# Altium schematic sheet Interface_Unit.SchDoc
size A4
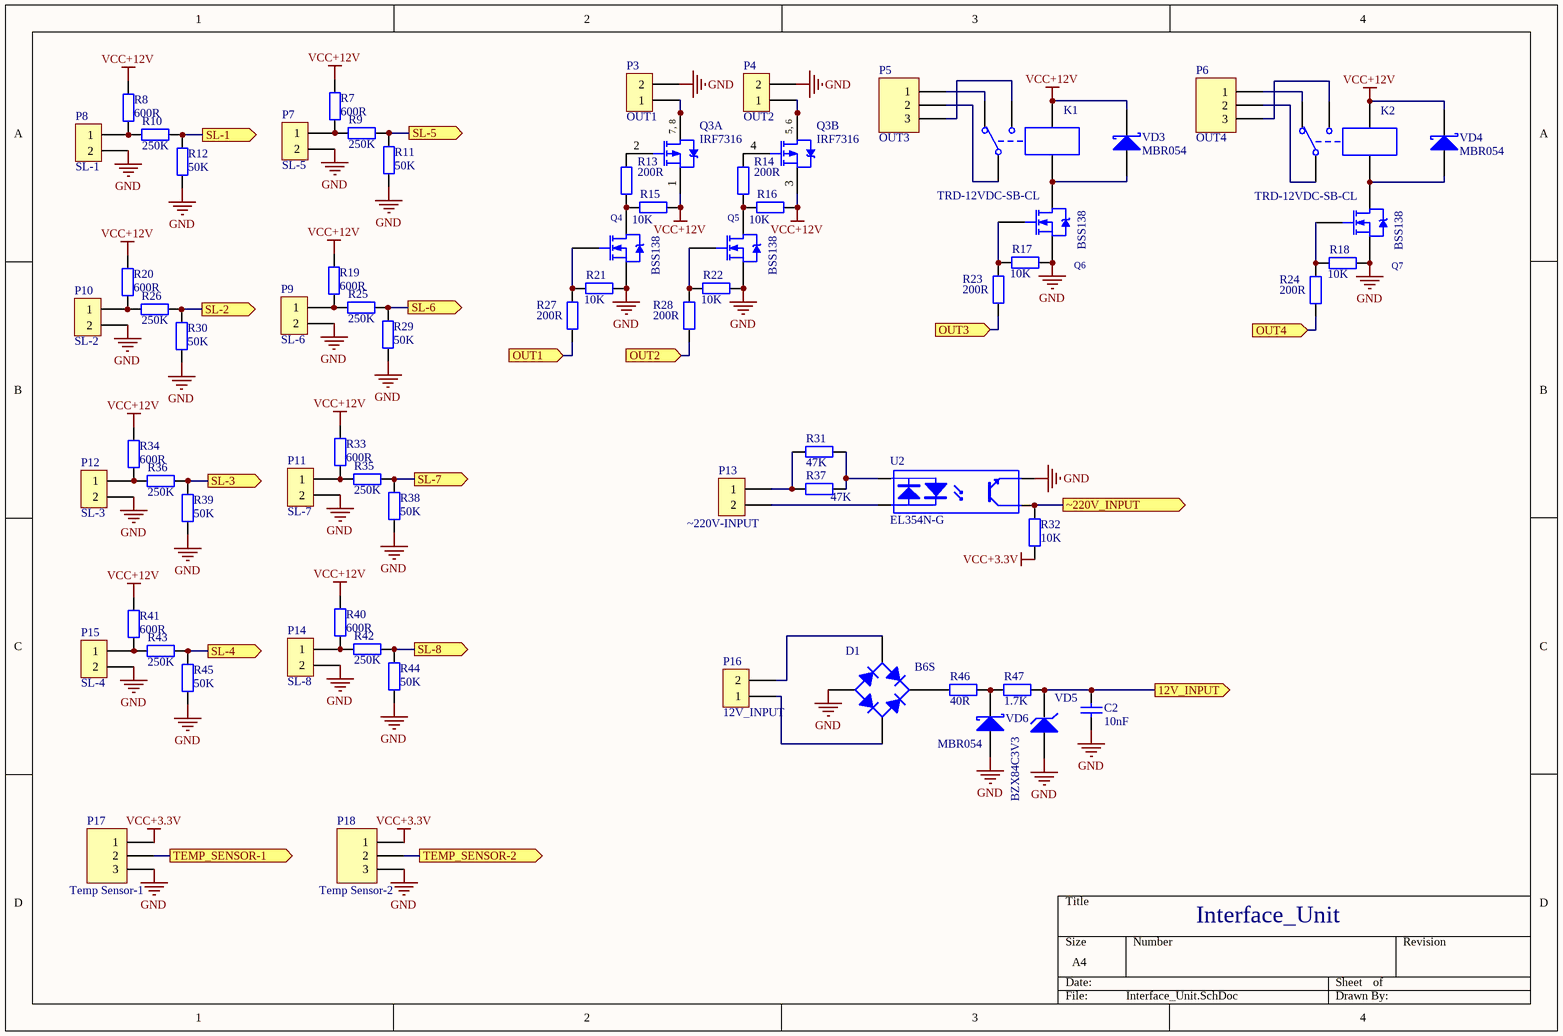
[diagram p0: Interface_Unit.SchDoc]

## Parts
C2  value 10nF  [C0603]  (hidden comment: 0805)
D1  B6S  [B6S]
K1  TRD-12VDC-SB-CL  [TRD-C Type]
K2  TRD-12VDC-SB-CL  [TRD-C Type]
P3  15EDGRC-3.5-02P  [15EDGRC-3.5-02P]  (value not drawn)
P4  15EDGRC-3.5-02P  [15EDGRC-3.5-02P]  (value not drawn)
P5  OUT3  [15EDGRC-3.5-03P]
P6  OUT4  [15EDGRC-3.5-03P]
P7  15EDGRC-3.5-02P  [15EDGRC-3.5-02P]  (value not drawn)
P8  15EDGRC-3.5-02P  [15EDGRC-3.5-02P]  (value not drawn)
P9  15EDGRC-3.5-02P  [15EDGRC-3.5-02P]  (value not drawn)
P10  15EDGRC-3.5-02P  [15EDGRC-3.5-02P]  (value not drawn)
P11  15EDGRC-3.5-02P  [15EDGRC-3.5-02P]  (value not drawn)
P12  15EDGRC-3.5-02P  [15EDGRC-3.5-02P]  (value not drawn)
P13  15EDGRC-3.5-02P  [15EDGRC-3.5-02P]  (value not drawn)
P14  15EDGRC-3.5-02P  [15EDGRC-3.5-02P]  (value not drawn)
P15  15EDGRC-3.5-02P  [15EDGRC-3.5-02P]  (value not drawn)
P16  15EDGRC-3.5-02P  [15EDGRC-3.5-02P]  (value not drawn)
P17  Temp Sensor-1  [15EDGRC-3.5-03P]
P18  Temp Sensor-2  [15EDGRC-3.5-03P]
Q3  IRF7316  [SO-8_N]  (parts A,B of 2)
Q4  BSS138  [SOT23]
Q5  BSS138  [SOT23]
Q6  BSS138  [SOT23]
Q7  BSS138  [SOT23]
R7  value 600R  [SMD-1206]  (hidden comment: RES_SMD)
R8  value 600R  [SMD-1206]  (hidden comment: RES_SMD)
R9  value 250K  [C0603]  (hidden comment: RES_SMD)
R10  value 250K  [C0603]  (hidden comment: RES_SMD)
R11  value 50K  [C0603]  (hidden comment: RES_SMD)
R12  value 50K  [C0603]  (hidden comment: RES_SMD)
R13  value 200R  [C0603]  (hidden comment: RES_SMD)
R14  value 200R  [C0603]  (hidden comment: RES_SMD)
R15  value 10K  [C0603]  (hidden comment: RES_SMD)
R16  value 10K  [C0603]  (hidden comment: RES_SMD)
R17  value 10K  [C0603]  (hidden comment: RES_SMD)
R18  value 10K  [C0603]  (hidden comment: RES_SMD)
R19  value 600R  [SMD-1206]  (hidden comment: RES_SMD)
R20  value 600R  [SMD-1206]  (hidden comment: RES_SMD)
R21  value 10K  [C0603]  (hidden comment: RES_SMD)
R22  value 10K  [C0603]  (hidden comment: RES_SMD)
R23  value 200R  [C0603]  (hidden comment: RES_SMD)
R24  value 200R  [C0603]  (hidden comment: RES_SMD)
R25  value 250K  [C0603]  (hidden comment: RES_SMD)
R26  value 250K  [C0603]  (hidden comment: RES_SMD)
R27  value 200R  [C0603]  (hidden comment: RES_SMD)
R28  value 200R  [C0603]  (hidden comment: RES_SMD)
R29  value 50K  [C0603]  (hidden comment: RES_SMD)
R30  value 50K  [C0603]  (hidden comment: RES_SMD)
R31  value 47K  [SMD-2512]  (hidden comment: RES_SMD)
R32  value 10K  [C0603]  (hidden comment: RES_SMD)
R33  value 600R  [SMD-1206]  (hidden comment: RES_SMD)
R34  value 600R  [SMD-1206]  (hidden comment: RES_SMD)
R35  value 250K  [C0603]  (hidden comment: RES_SMD)
R36  value 250K  [C0603]  (hidden comment: RES_SMD)
R37  value 47K  [SMD-2512]  (hidden comment: RES_SMD)
R38  value 50K  [C0603]  (hidden comment: RES_SMD)
R39  value 50K  [C0603]  (hidden comment: RES_SMD)
R40  value 600R  [SMD-1206]  (hidden comment: RES_SMD)
R41  value 600R  [SMD-1206]  (hidden comment: RES_SMD)
R42  value 250K  [C0603]  (hidden comment: RES_SMD)
R43  value 250K  [C0603]  (hidden comment: RES_SMD)
R44  value 50K  [C0603]  (hidden comment: RES_SMD)
R45  value 50K  [C0603]  (hidden comment: RES_SMD)
R46  value 40R  [C0805]  (hidden comment: RES)
R47  value 1.7K  [C0805]  (hidden comment: RES)
U2  EL354N-G  [EL354N-G]
VD3  MBR054  [SOD-123]
VD4  MBR054  [SOD-123]
VD5  BZX84C3V3  [SOT23]
VD6  MBR054  [SOD-123]

## Ports
12V_INPUT (out), OUT1 (in), OUT2 (in), OUT3 (in), OUT4 (in), SL-1 (out), SL-2 (out), SL-3 (out), SL-4 (out), SL-5 (out), SL-6 (out), SL-7 (out), SL-8 (out), TEMP_SENSOR-1 (out), TEMP_SENSOR-2 (out), ~220V_INPUT (out)

## Nets
GND: C2.2 D1.3(A) P3.2 P4.2 P7.2 P8.2 P9.2 P10.2 P11.2 P12.2 P14.2 P15.2 P17.3 P18.3 Q4.2(S) Q5.2(S) Q6.2(S) Q7.2(S) R11.1 R12.1 R17.2 R18.2 R21.2 R22.2 R29.1 R30.1 R38.1 R39.1 R44.1 R45.1 U2.3 VD5.1(A) VD6.2(A)
VCC+3.3V: P17.1 P18.1 R32.1
VCC+12V: K1.2 K2.2 Q3.1(S) Q3.3(S) R7.2 R8.2 R15.2 R16.2 R19.2 R20.2 R33.2 R34.2 R40.2 R41.2 VD3.1(K) VD4.1(K)
12V_INPUT: C2.1 R47.2 VD5.3(K) ; port 12V_INPUT
OUT1: R27.1 ; port OUT1
OUT2: R28.1 ; port OUT2
OUT3: R23.1 ; port OUT3
OUT4: R24.1 ; port OUT4
SL-1: R10.2 R12.2 ; port SL-1
SL-2: R26.2 R30.2 ; port SL-2
SL-3: R36.2 R39.2 ; port SL-3
SL-4: R43.2 R45.2 ; port SL-4
SL-5: R9.2 R11.2 ; port SL-5
SL-6: R25.2 R29.2 ; port SL-6
SL-7: R35.2 R38.2 ; port SL-7
SL-8: R42.2 R44.2 ; port SL-8
TEMP_SENSOR-1: P17.2 ; port TEMP_SENSOR-1
TEMP_SENSOR-2: P18.2 ; port TEMP_SENSOR-2
~220V_INPUT: R32.2 U2.4 ; port ~220V_INPUT
NetD1_1: D1.1(K) R46.1
NetD1_2: D1.2(C) P16.1
NetD1_4: D1.4(C) P16.2
NetK1_1: K1.1 Q6.3(D) VD3.2(A)
NetK1_3: K1.3 P5.2
NetK1_4: K1.4 P5.1
NetK1_5: K1.5 P5.3
NetK2_1: K2.1 Q7.3(D) VD4.2(A)
NetK2_3: K2.3 P6.2
NetK2_4: K2.4 P6.1
NetK2_5: K2.5 P6.3
NetP3_1: P3.1 Q3.7(D) Q3.8(D)
NetP4_1: P4.1 Q3.5(D) Q3.6(D)
NetP7_1: P7.1 R7.1 R9.1
NetP8_1: P8.1 R8.1 R10.1
NetP9_1: P9.1 R19.1 R25.1
NetP10_1: P10.1 R20.1 R26.1
NetP11_1: P11.1 R33.1 R35.1
NetP12_1: P12.1 R34.1 R36.1
NetP13_1: P13.1 R31.1 R37.1
NetP13_2: P13.2 U2.1
NetP14_1: P14.1 R40.1 R42.1
NetP15_1: P15.1 R41.1 R43.1
NetQ3_2: Q3.2(G) R13.2
NetQ3_4: Q3.4(G) R14.2
NetQ4_1: Q4.1(G) R21.1 R27.2
NetQ4_3: Q4.3(D) R13.1 R15.1
NetQ5_1: Q5.1(G) R22.1 R28.2
NetQ5_3: Q5.3(D) R14.1 R16.1
NetQ6_1: Q6.1(G) R17.1 R23.2
NetQ7_1: Q7.1(G) R18.1 R24.2
NetR31_2: R31.2 R37.2 U2.2
NetR46_2: R46.2 R47.1 VD6.1(K)

Not connected (* = marked no-connect by the designer): VD5 2

## Notes on the sheet
- Interface_Unit
- (in symbol 15EDGRC-3.5-02P) SL-1; SL-2; SL-3; SL-4; SL-5; SL-6; SL-7; SL-8; OUT1; OUT2; |20V-INPUT; 12V_INPUT
- (in symbol IRF7316, part A) 7, 8
- (in symbol IRF7316, part B) 5, 6

## Library data of the parts
C2 = Capasitor_SMD_0805: Capasitor_SMD_0808/
D1 = B6S: Diode Bridge
P5 P6 P17 P18 = 15EDGRC-3.5-03P
Q3 = IRF7316: HEXFET Power MOSFET; Published: 8-Jun-2000; LatestRevisionDate: 13-Apr-2006; LatestRevisionNote: IPC-7351 Footprint Added.; DatasheetVersion: Aug-1997; PackageVersion: Feb-2001; PackageReference: SO-8; Publisher: Altium Limited; PackageDescription: 8-Pin Plastic Small Outline Integrated Circuit 1.27 mm Pitch; Code_JEDEC: MS-012-AA; Code_IPC: SOIC127P600-8; ComponentLink1Description: Manufacturer Link; ComponentLink1URL: http://www.irf.com/; ComponentLink2Description: Datasheet; ComponentLink2URL: http://www.irf.com/product-info/datasheets/data/irf7316.pdf
Q4-Q7 = BSS138-SOT23
R7-R47 = RES: Resistor
U2 = EL354N
VD5 = BZX84C: Value: *